# Altium schematic sheet 35.SchDoc
size A3
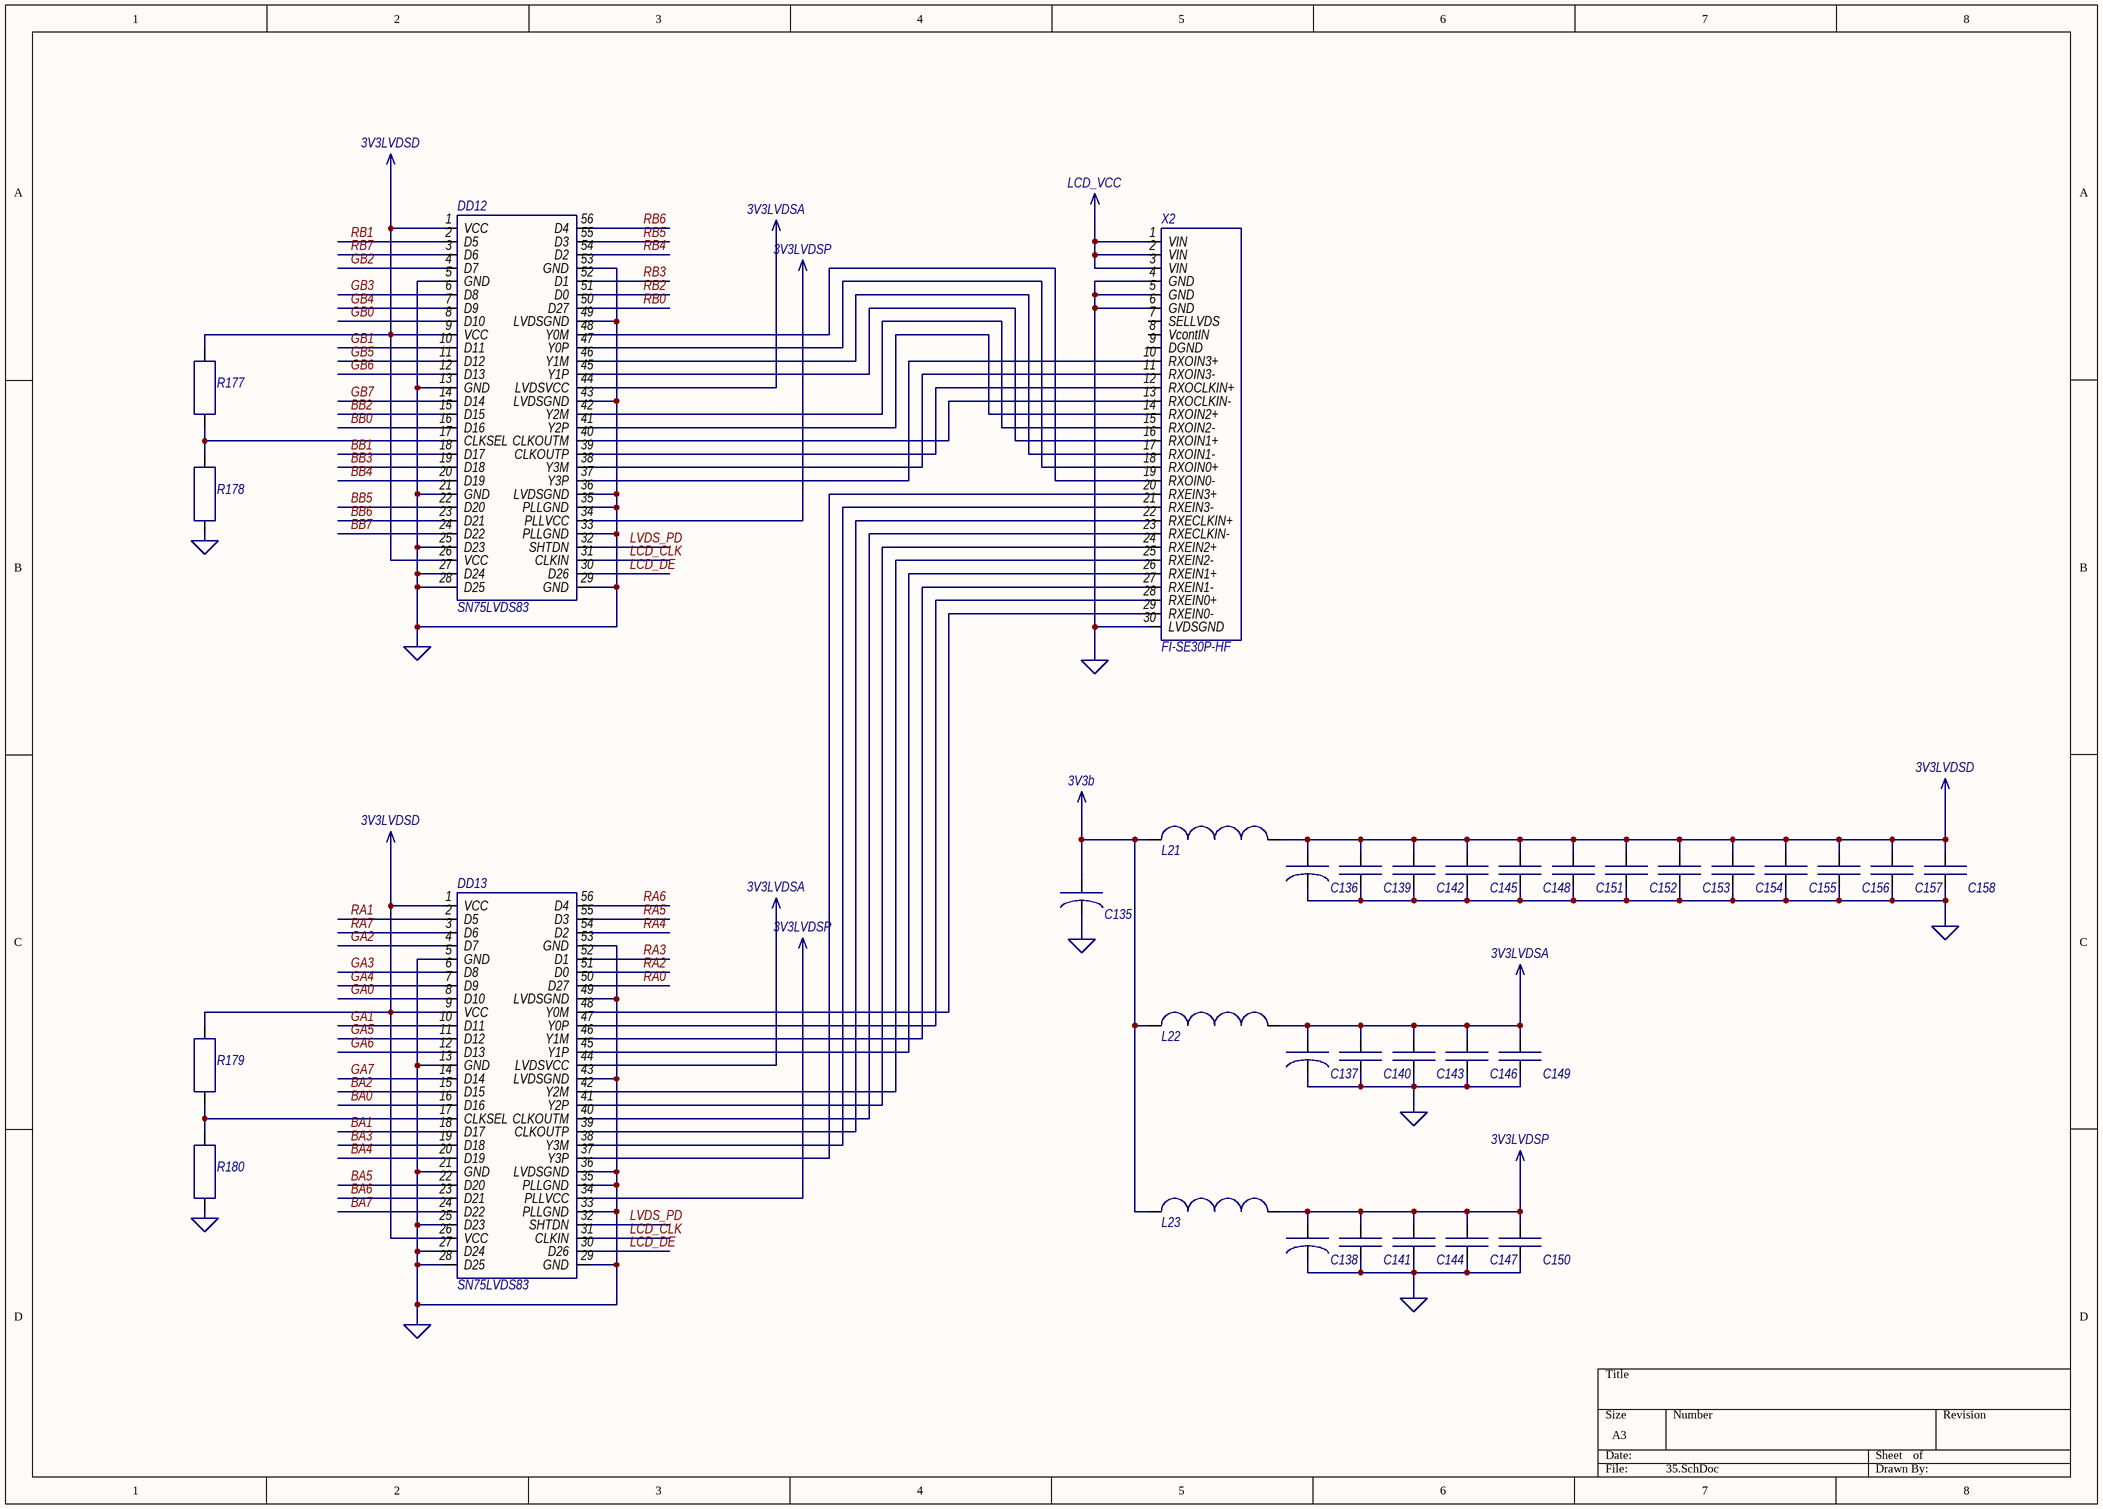
[diagram p0: 35.SchDoc]

## Parts
C135  TuningCapacitor  [Cap_tantal_D]  (value not drawn)
C136  TuningCapacitor  [Cap_tantal_D]  (value not drawn)
C137  TuningCapacitor  [Cap_tantal_D]  (value not drawn)
C138  TuningCapacitor  [Cap_tantal_D]  (value not drawn)
C139  Capacitor  [cap_electro_13]  (value not drawn)
C140  Capacitor  [cap_electro_13]  (value not drawn)
C141  Capacitor  [cap_electro_13]  (value not drawn)
C142  Capacitor  [cap_electro_13]  (value not drawn)
C143  Capacitor  [cap_electro_13]  (value not drawn)
C144  Capacitor  [cap_electro_13]  (value not drawn)
C145  Capacitor  [cap_electro_13]  (value not drawn)
C146  Capacitor  [cap_electro_13]  (value not drawn)
C147  Capacitor  [cap_electro_13]  (value not drawn)
C148  Capacitor  [cap_electro_13]  (value not drawn)
C149  Capacitor  [cap_electro_13]  (value not drawn)
C150  Capacitor  [cap_electro_13]  (value not drawn)
C151  Capacitor  [cap_electro_13]  (value not drawn)
C152  Capacitor  [cap_electro_13]  (value not drawn)
C153  Capacitor  [cap_electro_13]  (value not drawn)
C154  Capacitor  [cap_electro_13]  (value not drawn)
C155  Capacitor  [cap_electro_13]  (value not drawn)
C156  Capacitor  [cap_electro_13]  (value not drawn)
C157  Capacitor  [cap_electro_13]  (value not drawn)
C158  Capacitor  [cap_electro_13]  (value not drawn)
DD12  SN75LVDS83  [SN75LVDS83_v2]
DD13  SN75LVDS83  [SN75LVDS83_v2]
L21  Inductor  [inductor]  (value not drawn)
L22  Inductor  [inductor]  (value not drawn)
L23  Inductor  [inductor]  (value not drawn)
R177  Resistor  [R_1206]  (value not drawn)
R178  Resistor  [R_1206]  (value not drawn)
R179  Resistor  [R_1206]  (value not drawn)
R180  Resistor  [R_1206]  (value not drawn)
X2  FI-SE30P-HF  [FI-SE30P-HF_v2]

## Nets
3V3b: C135.1 L21.1 L22.1 L23.1
3V3LVDSA: C137.1 C140.2 C143.2 C146.2 C149.2 DD12.44(LVDSVCC) DD13.44(LVDSVCC) L22.2
3V3LVDSD: C136.1 C139.2 C142.2 C145.2 C148.2 C151.2 C152.2 C153.2 C154.2 C155.2 C156.2 C157.2 C158.2 DD12.1(VCC) DD12.9(VCC) DD12.26(VCC) DD13.1(VCC) DD13.9(VCC) DD13.26(VCC) L21.2 R177.2 R179.2
3V3LVDSP: C138.1 C141.2 C144.2 C147.2 C150.2 DD12.34(PLLVCC) DD13.34(PLLVCC) L23.2
GND: C135.2 C136.2 C137.2 C138.2 C139.1 C140.1 C141.1 C142.1 C143.1 C144.1 C145.1 C146.1 C147.1 C148.1 C149.1 C150.1 C151.1 C152.1 C153.1 C154.1 C155.1 C156.1 C157.1 C158.1 DD12.5(GND) DD12.13(GND) DD12.21(GND) DD12.25(D23) DD12.27(D24) DD12.28(D25) DD12.29(GND) DD12.33(PLLGND) DD12.35(PLLGND) DD12.36(LVDSGND) DD12.43(LVDSGND) DD12.49(LVDSGND) DD12.53(GND) DD13.5(GND) DD13.13(GND) DD13.21(GND) DD13.25(D23) DD13.27(D24) DD13.28(D25) DD13.29(GND) DD13.33(PLLGND) DD13.35(PLLGND) DD13.36(LVDSGND) DD13.43(LVDSGND) DD13.49(LVDSGND) DD13.53(GND) R178.1 R180.1 X2.4(GND) X2.5(GND) X2.6(GND) X2.30(LVDSGND)
LCD_VCC: X2.1(VIN) X2.2(VIN) X2.3(VIN)
BA0: DD13.16(D16)
BA1: DD13.18(D17)
BA2: DD13.15(D15)
BA3: DD13.19(D18)
BA4: DD13.20(D19)
BA5: DD13.22(D20)
BA6: DD13.23(D21)
BA7: DD13.24(D22)
BB0: DD12.16(D16)
BB1: DD12.18(D17)
BB2: DD12.15(D15)
BB3: DD12.19(D18)
BB4: DD12.20(D19)
BB5: DD12.22(D20)
BB6: DD12.23(D21)
BB7: DD12.24(D22)
GA0: DD13.8(D10)
GA1: DD13.10(D11)
GA2: DD13.4(D7)
GA3: DD13.6(D8)
GA4: DD13.7(D9)
GA5: DD13.11(D12)
GA6: DD13.12(D13)
GA7: DD13.14(D14)
GB0: DD12.8(D10)
GB1: DD12.10(D11)
GB2: DD12.4(D7)
GB3: DD12.6(D8)
GB4: DD12.7(D9)
GB5: DD12.11(D12)
GB6: DD12.12(D13)
GB7: DD12.14(D14)
LCD_CLK: DD12.31(CLKIN) DD13.31(CLKIN)
LCD_DE: DD12.30(D26) DD13.30(D26)
LVDS_PD: DD12.32(SHTDN) DD13.32(SHTDN)
RA0: DD13.50(D27)
RA1: DD13.2(D5)
RA2: DD13.51(D0)
RA3: DD13.52(D1)
RA4: DD13.54(D2)
RA5: DD13.55(D3)
RA6: DD13.56(D4)
RA7: DD13.3(D6)
RB0: DD12.50(D27)
RB1: DD12.2(D5)
RB2: DD12.51(D0)
RB3: DD12.52(D1)
RB4: DD12.54(D2)
RB5: DD12.55(D3)
RB6: DD12.56(D4)
RB7: DD12.3(D6)
NetDD12_17: DD12.17(CLKSEL) R177.1 R178.2
NetDD12_37: DD12.37(Y3P) X2.10(RXOIN3+)
NetDD12_38: DD12.38(Y3M) X2.11(RXOIN3-)
NetDD12_39: DD12.39(CLKOUTP) X2.12(RXOCLKIN+)
NetDD12_40: DD12.40(CLKOUTM) X2.13(RXOCLKIN-)
NetDD12_41: DD12.41(Y2P) X2.14(RXOIN2+)
NetDD12_42: DD12.42(Y2M) X2.15(RXOIN2-)
NetDD12_45: DD12.45(Y1P) X2.16(RXOIN1+)
NetDD12_46: DD12.46(Y1M) X2.17(RXOIN1-)
NetDD12_47: DD12.47(Y0P) X2.18(RXOIN0+)
NetDD12_48: DD12.48(Y0M) X2.19(RXOIN0-)
NetDD13_17: DD13.17(CLKSEL) R179.1 R180.2
NetDD13_37: DD13.37(Y3P) X2.20(RXEIN3+)
NetDD13_38: DD13.38(Y3M) X2.21(RXEIN3-)
NetDD13_39: DD13.39(CLKOUTP) X2.22(RXECLKIN+)
NetDD13_40: DD13.40(CLKOUTM) X2.23(RXECLKIN-)
NetDD13_41: DD13.41(Y2P) X2.24(RXEIN2+)
NetDD13_42: DD13.42(Y2M) X2.25(RXEIN2-)
NetDD13_45: DD13.45(Y1P) X2.26(RXEIN1+)
NetDD13_46: DD13.46(Y1M) X2.27(RXEIN1-)
NetDD13_47: DD13.47(Y0P) X2.28(RXEIN0+)
NetDD13_48: DD13.48(Y0M) X2.29(RXEIN0-)

Not connected (* = marked no-connect by the designer): X2 7(SELLVDS) 8(VcontIN) 9(DGND)